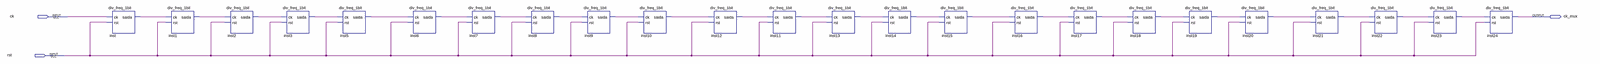
[diagram p0: schematic sheet, whole]
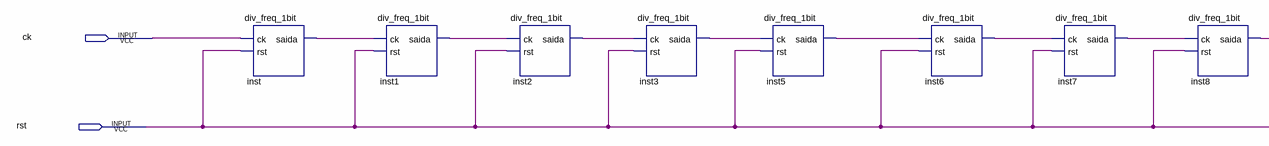
[diagram p1: schematic sheet, left part]
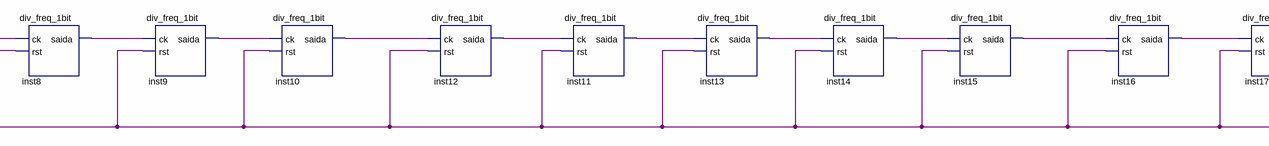
[diagram p2: schematic sheet, centre part]
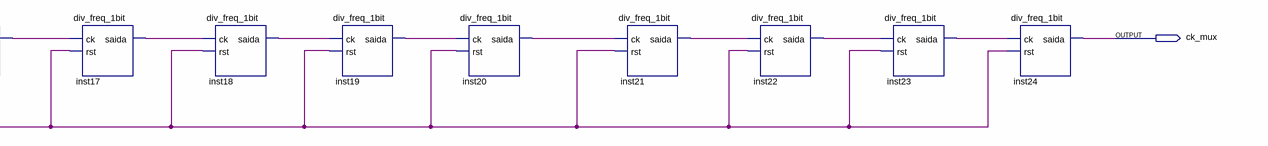
[diagram p3: schematic sheet, right part]
// Quartus schematic div_freq_FINAL.bdf as structural Verilog: 24 symbols, 3 pins
module div_freq_FINAL (
  input  ck,
  input  rst,
  output ck_mux
);

  wire inst1_saida, inst2_saida, inst3_saida, inst5_saida, inst6_saida, inst7_saida, inst8_saida,
       inst9_saida, inst10_saida, inst11_saida, inst12_saida, inst13_saida, inst14_saida, inst15_saida,
       inst16_saida, inst17_saida, inst18_saida, inst19_saida, inst20_saida, inst21_saida, inst22_saida,
       inst23_saida, inst_saida;

  div_freq_1bit inst (.ck(ck), .rst(rst), .saida(inst_saida));
  div_freq_1bit inst1 (.ck(inst_saida), .rst(rst), .saida(inst1_saida));
  div_freq_1bit inst2 (.ck(inst1_saida), .rst(rst), .saida(inst2_saida));
  div_freq_1bit inst3 (.ck(inst2_saida), .rst(rst), .saida(inst3_saida));
  div_freq_1bit inst5 (.ck(inst3_saida), .rst(rst), .saida(inst5_saida));
  div_freq_1bit inst6 (.ck(inst5_saida), .rst(rst), .saida(inst6_saida));
  div_freq_1bit inst7 (.ck(inst6_saida), .rst(rst), .saida(inst7_saida));
  div_freq_1bit inst8 (.ck(inst7_saida), .rst(rst), .saida(inst8_saida));
  div_freq_1bit inst9 (.ck(inst8_saida), .rst(rst), .saida(inst9_saida));
  div_freq_1bit inst10 (.ck(inst9_saida), .rst(rst), .saida(inst10_saida));
  div_freq_1bit inst12 (.ck(inst10_saida), .rst(rst), .saida(inst12_saida));
  div_freq_1bit inst11 (.ck(inst12_saida), .rst(rst), .saida(inst11_saida));
  div_freq_1bit inst13 (.ck(inst11_saida), .rst(rst), .saida(inst13_saida));
  div_freq_1bit inst14 (.ck(inst13_saida), .rst(rst), .saida(inst14_saida));
  div_freq_1bit inst15 (.ck(inst14_saida), .rst(rst), .saida(inst15_saida));
  div_freq_1bit inst16 (.ck(inst15_saida), .rst(rst), .saida(inst16_saida));
  div_freq_1bit inst17 (.ck(inst16_saida), .rst(rst), .saida(inst17_saida));
  div_freq_1bit inst18 (.ck(inst17_saida), .rst(rst), .saida(inst18_saida));
  div_freq_1bit inst19 (.ck(inst18_saida), .rst(rst), .saida(inst19_saida));
  div_freq_1bit inst20 (.ck(inst19_saida), .rst(rst), .saida(inst20_saida));
  div_freq_1bit inst21 (.ck(inst20_saida), .rst(rst), .saida(inst21_saida));
  div_freq_1bit inst22 (.ck(inst21_saida), .rst(rst), .saida(inst22_saida));
  div_freq_1bit inst23 (.ck(inst22_saida), .rst(rst), .saida(inst23_saida));
  div_freq_1bit inst24 (.ck(inst23_saida), .rst(rst), .saida(ck_mux));
endmodule
